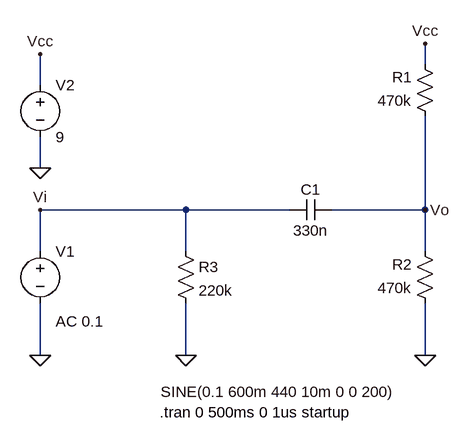
[diagram p0: schematic DCOffsetInputFilter.asc]
DCOffsetInputFilter.asc, the LTspice schematic file:
Version 4
SHEET 1 880 1840
WIRE 32 1264 32 1232
WIRE -560 1296 -560 1248
WIRE -560 1424 -560 1376
WIRE -336 1488 -560 1488
WIRE -176 1488 -336 1488
WIRE 32 1488 32 1344
WIRE 32 1488 -112 1488
WIRE -560 1552 -560 1488
WIRE -336 1552 -336 1488
WIRE 32 1552 32 1488
WIRE -560 1712 -560 1632
WIRE -336 1712 -336 1632
WIRE 32 1712 32 1632
FLAG -336 1712 0
FLAG -560 1712 0
FLAG 32 1712 0
FLAG 32 1232 Vcc
FLAG -560 1248 Vcc
FLAG -560 1424 0
FLAG -560 1488 Vi
FLAG 32 1488 Vo
SYMBOL res 48 1360 R180
WINDOW 0 36 76 Left 2
WINDOW 3 36 40 Left 2
SYMATTR InstName R1
SYMATTR Value 470k
SYMBOL res 48 1648 R180
WINDOW 0 36 76 Left 2
WINDOW 3 36 40 Left 2
SYMATTR InstName R2
SYMATTR Value 470k
SYMBOL res -352 1536 R0
SYMATTR InstName R3
SYMATTR Value 220k
SYMBOL cap -112 1472 R90
WINDOW 0 0 32 VBottom 2
WINDOW 3 32 32 VTop 2
SYMATTR InstName C1
SYMATTR Value 330n
SYMBOL voltage -560 1536 R0
WINDOW 3 185 232 Left 2
WINDOW 123 24 124 Left 2
WINDOW 39 0 0 Left 0
SYMATTR Value SINE(0.1 600m 440 10m 0 0 200)
SYMATTR Value2 AC 0.1
SYMATTR InstName V1
SYMBOL voltage -560 1280 R0
WINDOW 123 0 0 Left 0
WINDOW 39 0 0 Left 0
SYMATTR InstName V2
SYMATTR Value 9
TEXT -376 1800 Left 2 !.tran 0 500ms 0 1us startup

The netlist it stands for:
* DCOffsetInputFilter.asc
R1 Vo Vcc 470k
R2 0 Vo 470k
R3 Vi 0 220k
C1 Vo Vi 330n
V1 Vi 0 SINE(0.1 600m 440 10m 0 0 200) AC 0.1
V2 Vcc 0 9
.tran 0 500ms 0 1us startup
.backanno
.end